# Altium project TR8253-EVB-PDI-1_0.PrjPCB
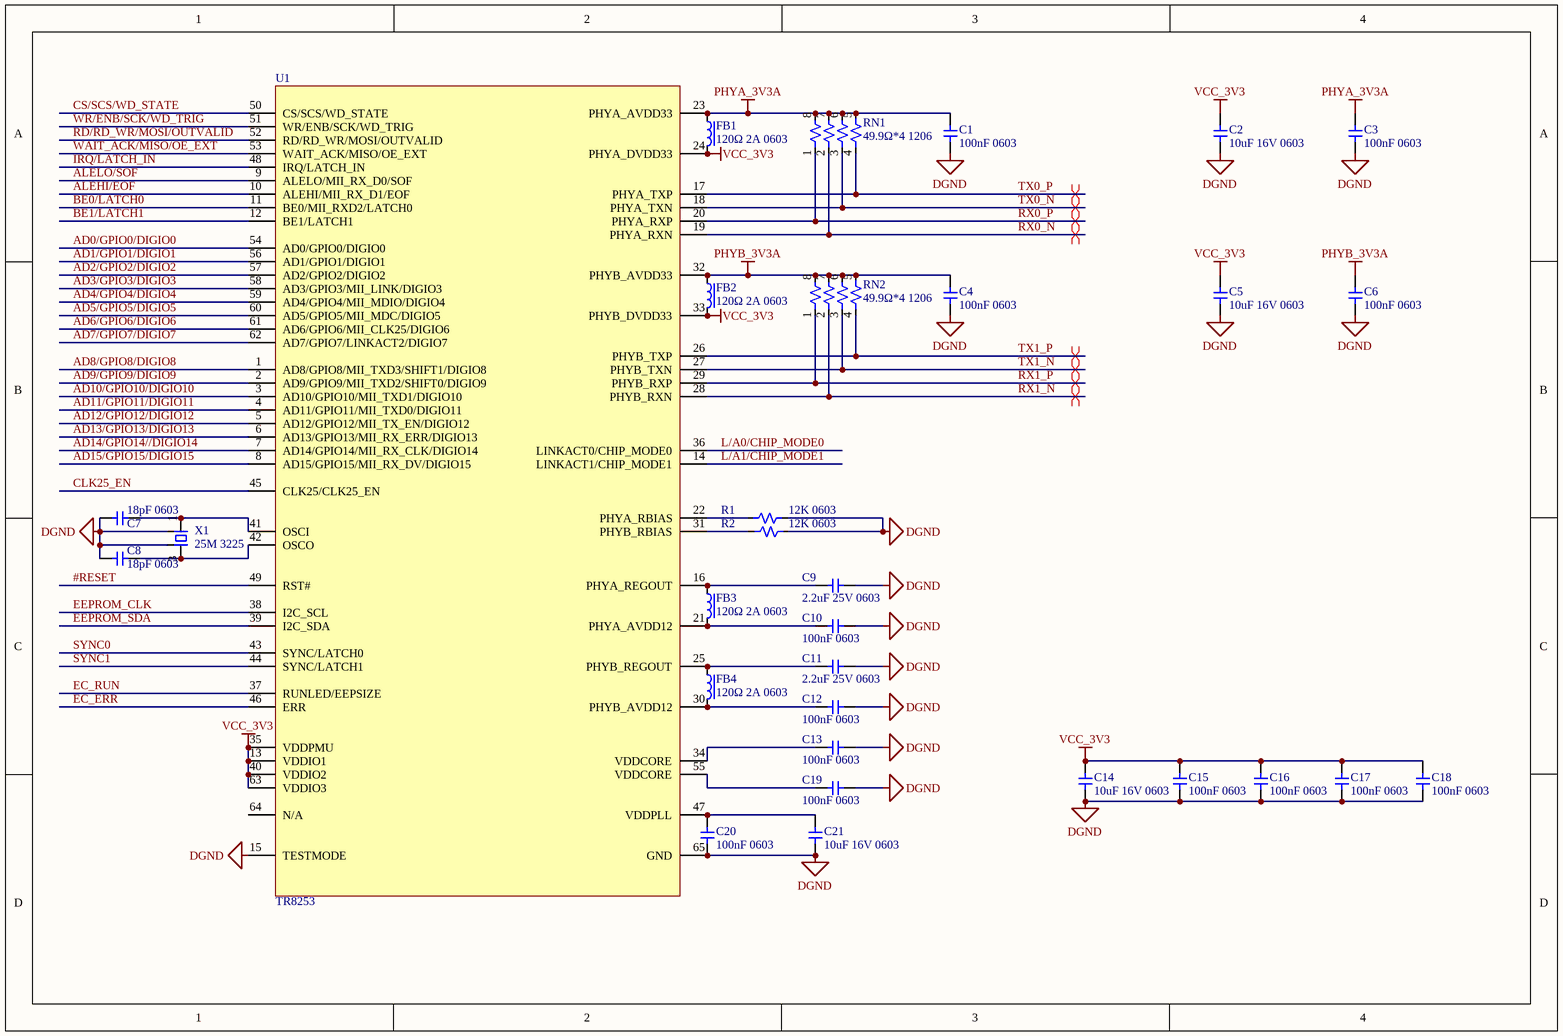
[diagram p0: SCH-TR8253.SchDoc]
5 sheets, 103 parts. Net scope: global (net labels, ports and power ports of the same name join across sheets).
Board files: TR8253-EVB-PDI-1_0.PcbDoc, TR8253-EVB-PDI-拼板x4-1_0.PcbDoc
Sheets:
  SCH-TR8253.SchDoc
  SCH-TR8253_config.SchDoc
  SCH-EC_port.SchDoc
  SCH-Power.SchDoc
  SCH-Connector.SchDoc

## Sheet SCH-TR8253.SchDoc
size A4

### Parts
C1  100nF 0603  [CAPC1608X08 (0603)]
C2  10uF 16V 0603  [CAPC1608X08 (0603)]
C3  100nF 0603  [CAPC1608X08 (0603)]
C4  100nF 0603  [CAPC1608X08 (0603)]
C5  10uF 16V 0603  [CAPC1608X08 (0603)]
C6  100nF 0603  [CAPC1608X08 (0603)]
C7  18pF 0603  [CAPC1608X08 (0603)]
C8  18pF 0603  [CAPC1608X08 (0603)]
C9  2.2uF 25V 0603  [CAPC1608X08 (0603)]
C10  100nF 0603  [CAPC1608X08 (0603)]
C11  2.2uF 25V 0603  [CAPC1608X08 (0603)]
C12  100nF 0603  [CAPC1608X08 (0603)]
C13  100nF 0603  [CAPC1608X08 (0603)]
C14  10uF 16V 0603  [CAPC1608X08 (0603)]
C15  100nF 0603  [CAPC1608X08 (0603)]
C16  100nF 0603  [CAPC1608X08 (0603)]
C17  100nF 0603  [CAPC1608X08 (0603)]
C18  100nF 0603  [CAPC1608X08 (0603)]
C19  100nF 0603  [CAPC1608X08 (0603)]
C20  100nF 0603  [CAPC1608X08 (0603)]
C21  10uF 16V 0603  [CAPC1608X08 (0603)]
FB1  120Ω 2A 0603  [INDC1608X08 (0603)]
FB2  120Ω 2A 0603  [INDC1608X08 (0603)]
FB3  120Ω 2A 0603  [INDC1608X08 (0603)]
FB4  120Ω 2A 0603  [INDC1608X08 (0603)]
R1  12K 0603  [RESC1608X04 (0603)]
R2  12K 0603  [RESC1608X04 (0603)]
RN1  49.9Ω*4 1206  [CAC-80P320X160-8 (1206)]
RN2  49.9Ω*4 1206  [CAC-80P320X160-8 (1206)]
U1  TR8253  [QFN50P900X900X100_HS-65M]
X1  25M 3225  [SON220P250X80-4N-(3225)]

### Nets
DGND: C1.1 C2.2 C3.2 C4.1 C5.2 C6.2 C7.2 C8.2 C9.2 C10.2 C11.2 C12.2 C13.2 C14.1 C15.1 C16.1 C17.1 C18.1 C19.2 C20.2 C21.2 R1.1 R2.2 U1.15(TESTMODE) U1.65(GND) X1.2 X1.4
PHYA_3V3A: C1.2 C3.1 FB1.1 RN1.5 RN1.6 RN1.7 RN1.8 U1.23(PHYA_AVDD33)
PHYB_3V3A: C4.2 C6.1 FB2.1 RN2.5 RN2.6 RN2.7 RN2.8 U1.32(PHYB_AVDD33)
VCC_3V3: C2.1 C5.1 C14.2 C15.2 C16.2 C17.2 C18.2 FB1.2 FB2.2 U1.13(VDDIO1) U1.24(PHYA_DVDD33) U1.33(PHYB_DVDD33) U1.35(VDDPMU) U1.40(VDDIO2) U1.63(VDDIO3)
#RESET: U1.49(RST#)
AD0/GPIO0/DIGIO0: U1.54(AD0/GPIO0/DIGIO0)
AD1/GPIO1/DIGIO1: U1.56(AD1/GPIO1/DIGIO1)
AD2/GPIO2/DIGIO2: U1.57(AD2/GPIO2/DIGIO2)
AD3/GPIO3/DIGIO3: U1.58(AD3/GPIO3/MII_LINK/DIGIO3)
AD4/GPIO4/DIGIO4: U1.59(AD4/GPIO4/MII_MDIO/DIGIO4)
AD5/GPIO5/DIGIO5: U1.60(AD5/GPIO5/MII_MDC/DIGIO5)
AD6/GPIO6/DIGIO6: U1.61(AD6/GPIO6/MII_CLK25/DIGIO6)
AD7/GPIO7/DIGIO7: U1.62(AD7/GPIO7/LINKACT2/DIGIO7)
AD8/GPIO8/DIGIO8: U1.1(AD8/GPIO8/MII_TXD3/SHIFT1/DIGIO8)
AD9/GPIO9/DIGIO9: U1.2(AD9/GPIO9/MII_TXD2/SHIFT0/DIGIO9)
AD10/GPIO10/DIGIO10: U1.3(AD10/GPIO10/MII_TXD1/DIGIO10)
AD11/GPIO11/DIGIO11: U1.4(AD11/GPIO11/MII_TXD0/DIGIO11)
AD12/GPIO12/DIGIO12: U1.5(AD12/GPIO12/MII_TX_EN/DIGIO12)
AD13/GPIO13/DIGIO13: U1.6(AD13/GPIO13/MII_RX_ERR/DIGIO13)
AD14/GPIO14//DIGIO14: U1.7(AD14/GPIO14/MII_RX_CLK/DIGIO14)
AD15/GPIO15/DIGIO15: U1.8(AD15/GPIO15/MII_RX_DV/DIGIO15)
ALEHI/EOF: U1.10(ALEHI/MII_RX_D1/EOF)
ALELO/SOF: U1.9(ALELO/MII_RX_D0/SOF)
BE0/LATCH0: U1.11(BE0/MII_RXD2/LATCH0)
BE1/LATCH1: U1.12(BE1/LATCH1)
CLK25_EN: U1.45(CLK25/CLK25_EN)
CS/SCS/WD_STATE: U1.50(CS/SCS/WD_STATE)
EC_ERR: U1.46(ERR)
EC_RUN: U1.37(RUNLED/EEPSIZE)
EEPROM_CLK: U1.38(I2C_SCL)
EEPROM_SDA: U1.39(I2C_SDA)
IRQ/LATCH_IN: U1.48(IRQ/LATCH_IN)
L/A0/CHIP_MODE0: U1.36(LINKACT0/CHIP_MODE0)
L/A1/CHIP_MODE1: U1.14(LINKACT1/CHIP_MODE1)
RD/RD_WR/MOSI/OUTVALID: U1.52(RD/RD_WR/MOSI/OUTVALID)
RX0_N: RN1.2 U1.19(PHYA_RXN)
RX0_P: RN1.1 U1.20(PHYA_RXP)
RX1_N: RN2.2 U1.28(PHYB_RXN)
RX1_P: RN2.1 U1.29(PHYB_RXP)
SYNC0: U1.43(SYNC/LATCH0)
SYNC1: U1.44(SYNC/LATCH1)
TX0_N: RN1.3 U1.18(PHYA_TXN)
TX0_P: RN1.4 U1.17(PHYA_TXP)
TX1_N: RN2.3 U1.27(PHYB_TXN)
TX1_P: RN2.4 U1.26(PHYB_TXP)
WAIT_ACK/MISO/OE_EXT: U1.53(WAIT_ACK/MISO/OE_EXT)
WR/ENB/SCK/WD_TRIG: U1.51(WR/ENB/SCK/WD_TRIG)
NetC7_1: C7.1 U1.41(OSCI) X1.1
NetC8_1: C8.1 U1.42(OSCO) X1.3
NetC9_1: C9.1 FB3.1 U1.16(PHYA_REGOUT)
NetC10_1: C10.1 FB3.2 U1.21(PHYA_AVDD12)
NetC11_1: C11.1 FB4.1 U1.25(PHYB_REGOUT)
NetC12_1: C12.1 FB4.2 U1.30(PHYB_AVDD12)
NetC13_1: C13.1 U1.34(VDDCORE)
NetC19_1: C19.1 U1.55(VDDCORE)
NetC20_1: C20.1 C21.1 U1.47(VDDPLL)
NetR1_2: R1.2 U1.22(PHYA_RBIAS)
NetR2_1: R2.1 U1.31(PHYB_RBIAS)

Not connected (* = marked no-connect by the designer): U1 64(N/A)

### Layout directives
differential pair: RX0_N, RX0_P, RX1_N, RX1_P, TX0_N, TX0_P, TX1_N, TX1_P

### Library data of the parts
C1 C3 C4 C6 C10 C12 C13 C15-C20 = 100nF 0603: 贴片MLCC电容 100nF 50V X7R 10% 0603; 1st Manufacturer: Yageo; 1st PartNumber: CC0603KRX7R9BB104; 2nd Manufacturer: TDK; 2nd PartNumber: CGA3E2X7R1H104K080AA; ERP_ID: 12A20039
C2 C5 C14 C21 = 10uF 16V 0603: 贴片MLCC电容 10uF 16V X5R 20% 0603; 1st Manufacturer: YAGEO; 1st PartNumber: CC0603KRX5R7BB106; ERP_ID: 12A20110
C7 C8 = 18pF 0603: 贴片MLCC电容 18pF 50V NPO 5% 0603; 1st Manufacturer: Yageo; 1st PartNumber: CC0603JRNPO9BN180; ERP_ID: 12A20092
C9 C11 = 2.2uF 25V 0603: 贴片MLCC电容 2.2uF 25V X5R 10% 0603; 1st Manufacturer: Yageo; 1st PartNumber: CC0603KRX5R8BB225; ERP_ID: 12A20113
FB1-FB4 = 120Ω@100MHz 2A 0603: 电源线磁珠 0603 120Ω@100MHz 2A; 1st PartNumber: PZ1608U121-2R0TF; 1st Manufacturer: 顺络; 2nd Manufacturer: Murata; 2nd PartNumber: BLM18PG121SN1D; ERP_ID: 12A40009
R1 R2 = 12K 0603: 贴片厚膜电阻 12kΩ 1% 0603; 1st Manufacturer: Yageo; 2nd Manufacturer: Bourns; 2nd PartNumber: CR0603-FX-1202ELF; 1st PartNumber: RC0603FR-0712KL; ERP_ID: 12A10055
RN1 RN2 = 49.9Ω*4 1206: 贴片排阻 49.9Ω 5% 4x0603; 1st Manufacturer: Yageo; 2nd Manufacturer: Bourns; 2nd PartNumber: CAY16-49R9F4LF; 1st PartNumber: YC164-FR-0749R9L; ERP_ID: 12A10157
U1 = TR8253: 2/3端口内置以太网PHY的EtherCAT从站控制器; 1st Manufacturer: 创耀; ERP_ID: -; 1st PartNumber: TR8253
X1 = 25M 20ppm 3225: 贴片无源晶振 25MHz 20ppm 12pF; 1st Manufacturer: TXC; 1st PartNumber: 7M-25.000MDHE-T; ERP_ID: 12A50002

## Sheet SCH-TR8253_config.SchDoc
size A4
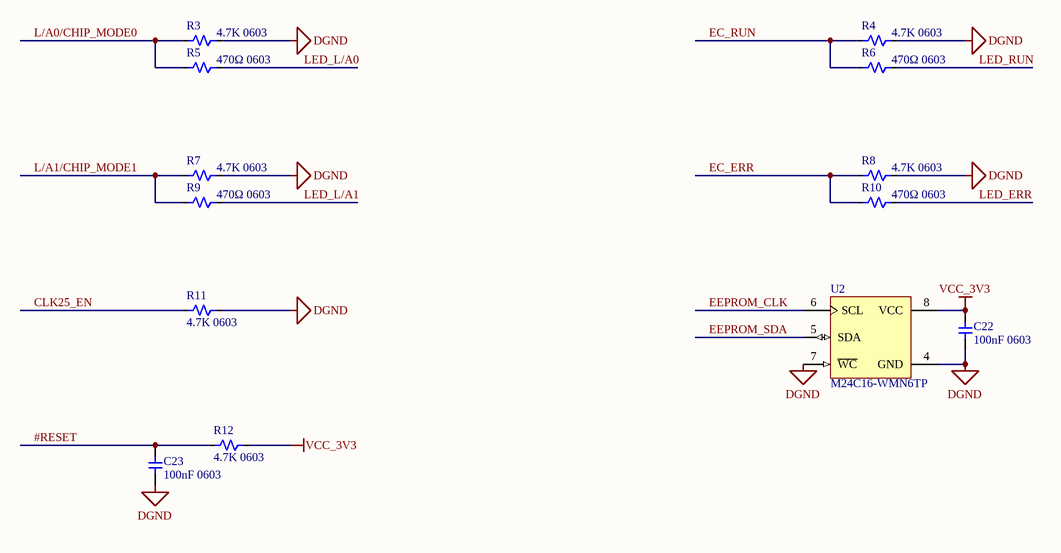
[diagram p1: SCH-TR8253_config.SchDoc]

### Parts
C22  100nF 0603  [CAPC1608X08 (0603)]
C23  100nF 0603  [CAPC1608X08 (0603)]
R3  4.7K 0603  [RESC1608X04 (0603)]
R4  4.7K 0603  [RESC1608X04 (0603)]
R5  470Ω 0603  [RESC1608X04 (0603)]
R6  470Ω 0603  [RESC1608X04 (0603)]
R7  4.7K 0603  [RESC1608X04 (0603)]
R8  4.7K 0603  [RESC1608X04 (0603)]
R9  470Ω 0603  [RESC1608X04 (0603)]
R10  470Ω 0603  [RESC1608X04 (0603)]
R11  4.7K 0603  [RESC1608X04 (0603)]
R12  4.7K 0603  [RESC1608X04 (0603)]
U2  M24C16-WMN6TP  [SOIC127P600X175-8N]

### Nets
DGND: C22.2 C23.2 R3.1 R4.1 R7.1 R8.1 R11.1 U2.4(GND) U2.7(~{WC})
VCC_3V3: C22.1 R12.1 U2.8(VCC)
#RESET: C23.1 R12.2
CLK25_EN: R11.2
EC_ERR: R8.2 R10.2
EC_RUN: R4.2 R6.2
EEPROM_CLK: U2.6(SCL)
EEPROM_SDA: U2.5(SDA)
L/A0/CHIP_MODE0: R3.2 R5.2
L/A1/CHIP_MODE1: R7.2 R9.2
LED_ERR: R10.1
LED_L/A0: R5.1
LED_L/A1: R9.1
LED_RUN: R6.1

### Library data of the parts
C22 C23 = 100nF 0603: as C1 on sheet SCH-TR8253
R3 R4 R7 R8 R11 R12 = 4.7K 0603: 贴片厚膜电阻 4.7kΩ 1% 0603; 1st Manufacturer: Yageo; 1st PartNumber: RC0603FR-074K7L; 2nd Manufacturer: Bourns; 2nd PartNumber: CR0603-FX-4701ELF; ERP_ID: 12A10041
R5 R6 R9 R10 = 470Ω 0603: 贴片厚膜电阻 470Ω 1% 0603; 1st Manufacturer: Yageo; 1st PartNumber: RC0603FR-07470RL; 2nd Manufacturer: Bourns; 2nd PartNumber: CR0603-FX-4700ELF; ERP_ID: 12A10103
U2 = M24C16-WMN6TP: I2C串行EEPROM 16K; 1st Manufacturer: ST; 2nd Manufacturer: 复旦微; 2nd PartNumber: FM24C16D-SO-T; ERP_ID: 11B20023; 1st PartNumber: M24C16-WMN6TP

## Sheet SCH-EC_port.SchDoc
size A4
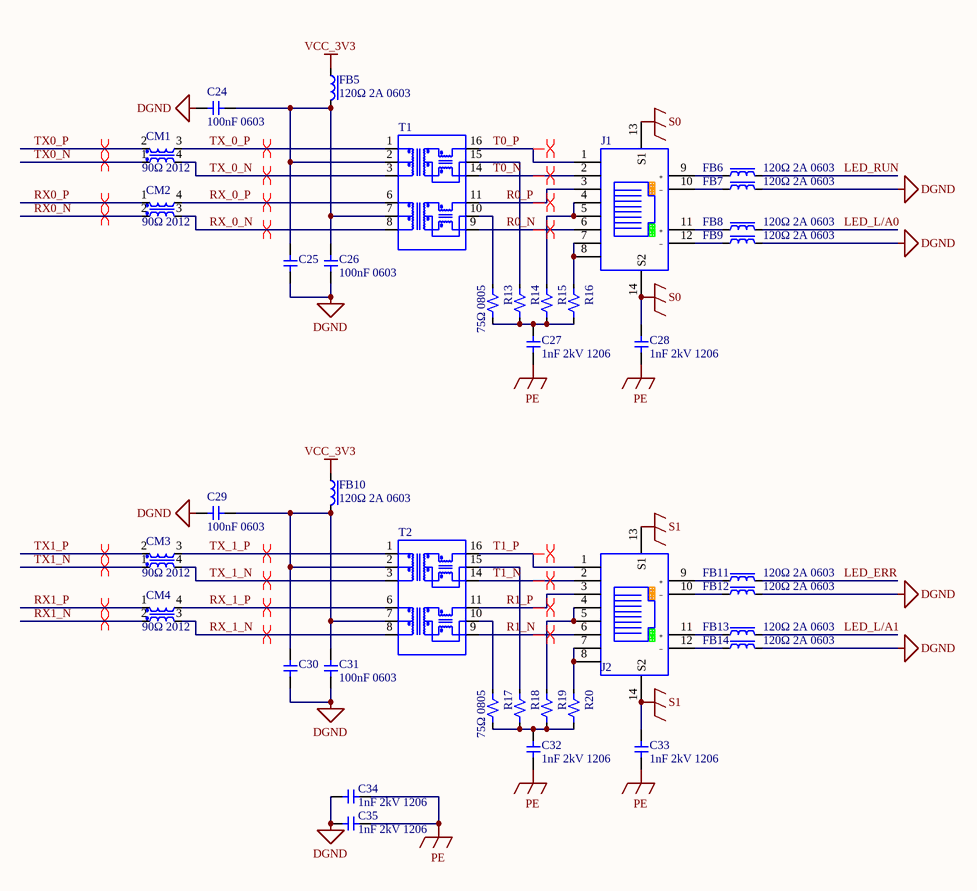
[diagram p2: SCH-EC_port.SchDoc]

### Parts
C24  100nF 0603  [CAPC1608X08 (0603)]
C25  100nF 0603  [CAPC1608X08 (0603)]  (value not drawn)
C26  100nF 0603  [CAPC1608X08 (0603)]
C27  1nF 2kV 1206  [CAPC3216X16 (1206)]
C28  1nF 2kV 1206  [CAPC3216X16 (1206)]
C29  100nF 0603  [CAPC1608X08 (0603)]
C30  100nF 0603  [CAPC1608X08 (0603)]  (value not drawn)
C31  100nF 0603  [CAPC1608X08 (0603)]
C32  1nF 2kV 1206  [CAPC3216X16 (1206)]
C33  1nF 2kV 1206  [CAPC3216X16 (1206)]
C34  1nF 2kV 1206  [CAPC3216X16 (1206)]
C35  1nF 2kV 1206  [CAPC3216X16 (1206)]
CM1  90Ω 2012  [CAF-80P120X200-4N]
CM2  90Ω 2012  [CAF-80P120X200-4N]
CM3  90Ω 2012  [CAF-80P120X200-4N]
CM4  90Ω 2012  [CAF-80P120X200-4N]
FB5  120Ω 2A 0603  [INDC1608X08 (0603)]
FB6  120Ω 2A 0603  [INDC1608X08 (0603)]
FB7  120Ω 2A 0603  [INDC1608X08 (0603)]
FB8  120Ω 2A 0603  [INDC1608X08 (0603)]
FB9  120Ω 2A 0603  [INDC1608X08 (0603)]
FB10  120Ω 2A 0603  [INDC1608X08 (0603)]
FB11  120Ω 2A 0603  [INDC1608X08 (0603)]
FB12  120Ω 2A 0603  [INDC1608X08 (0603)]
FB13  120Ω 2A 0603  [INDC1608X08 (0603)]
FB14  120Ω 2A 0603  [INDC1608X08 (0603)]
J1  1901-396X  [1901-396X]  (value not drawn)
J2  1901-396X  [1901-396X]  (value not drawn)
R13  75Ω 0805  [RESC2012X05 (0805)]
R14  75Ω 0805  [RESC2012X05 (0805)]  (value not drawn)
R15  75Ω 0805  [RESC2012X05 (0805)]  (value not drawn)
R16  75Ω 0805  [RESC2012X05 (0805)]  (value not drawn)
R17  75Ω 0805  [RESC2012X05 (0805)]
R18  75Ω 0805  [RESC2012X05 (0805)]  (value not drawn)
R19  75Ω 0805  [RESC2012X05 (0805)]  (value not drawn)
R20  75Ω 0805  [RESC2012X05 (0805)]  (value not drawn)
T1  H1601CE  [SOIC127P940X640-16N]  (value not drawn)
T2  H1601CE  [SOIC127P940X640-16N]  (value not drawn)

### Nets
DGND: C24.2 C25.2 C26.2 C29.2 C30.2 C31.2 C34.1 C35.1 FB7.2 FB9.2 FB12.2 FB14.2
PE: C27.2 C28.2 C32.2 C33.2 C34.2 C35.2
S0: C28.1 J1.13(S1) J1.14(S2)
S1: C33.1 J2.13(S1) J2.14(S2)
VCC_3V3: FB5.1 FB10.1
LED_ERR: FB11.2
LED_L/A0: FB8.2
LED_L/A1: FB13.2
LED_RUN: FB6.2
R0_N: J1.6(Rx-) T1.9
R0_P: J1.3(Rx+) T1.11
R1_N: J2.6(Rx-) T2.9
R1_P: J2.3(Rx+) T2.11
RX0_N: CM2.2
RX0_P: CM2.1
RX1_N: CM4.2
RX1_P: CM4.1
RX_0_N: CM2.3 T1.8
RX_0_P: CM2.4 T1.6
RX_1_N: CM4.3 T2.8
RX_1_P: CM4.4 T2.6
T0_N: J1.2(Tx-) T1.14
T0_P: J1.1(Tx+) T1.16
T1_N: J2.2(Tx-) T2.14
T1_P: J2.1(Tx+) T2.16
TX0_N: CM1.1
TX0_P: CM1.2
TX1_N: CM3.1
TX1_P: CM3.2
TX_0_N: CM1.4 T1.3
TX_0_P: CM1.3 T1.1
TX_1_N: CM3.4 T2.3
TX_1_P: CM3.3 T2.1
NetC24_1: C24.1 C25.1 C26.1 FB5.2 T1.2 T1.7
NetC27_1: C27.1 R13.1 R14.1 R15.1 R16.1
NetC29_1: C29.1 C30.1 C31.1 FB10.2 T2.2 T2.7
NetC32_1: C32.1 R17.1 R18.1 R19.1 R20.1
NetFB6_1: FB6.1 J1.9(﹢)
NetFB7_1: FB7.1 J1.10(﹣)
NetFB8_1: FB8.1 J1.11(﹢)
NetFB9_1: FB9.1 J1.12(﹣)
NetFB11_1: FB11.1 J2.9(﹢)
NetFB12_1: FB12.1 J2.10(﹣)
NetFB13_1: FB13.1 J2.11(﹢)
NetFB14_1: FB14.1 J2.12(﹣)
NetJ1_4: J1.4 J1.5 R15.2
NetJ1_7: J1.7 J1.8 R16.2
NetJ2_4: J2.4 J2.5 R19.2
NetJ2_7: J2.7 J2.8 R20.2
NetR13_2: R13.2 T1.10
NetR14_2: R14.2 T1.15
NetR17_2: R17.2 T2.10
NetR18_2: R18.2 T2.15

### Layout directives
differential pair: R0_N, R0_P, R1_N, R1_P, RX0_N, RX0_P, RX1_N, RX1_P, RX_0_N, RX_0_P, RX_1_N, RX_1_P, T0_N, T0_P, T1_N, T1_P, TX0_N, TX0_P, TX1_N, TX1_P, TX_0_N, TX_0_P, TX_1_N, TX_1_P

### Library data of the parts
C24-C26 C29-C31 = 100nF 0603: as C1 on sheet SCH-TR8253
C27 C28 C32-C35 = 1nF 2kV 1206: 贴片MLCC电容 1.0nF 2KV X7R 10% 1206; 1st Manufacturer: Yageo; 1st PartNumber: CC1206KKX7RDBB102; ERP_ID: 12A20057
CM1-CM4 = 90Ω@100MHz 2012: 高速信号共模滤波器 90Ω@100MHz, 0.33A, 2012; 1st PartNumber: SDCW2012-2-900TF; 1st Manufacturer: 顺络; 2nd Manufacturer: TDK; 2nd PartNumber: ACM2012E-900-2P-T01; ERP_ID: 12A40029
FB5-FB14 = 120Ω@100MHz 2A 0603: as FB1 on sheet SCH-TR8253
J1 J2 = 1901-396X: 以太网连接器 90度弯 带灯（左黄右绿）金属外壳 EMI弹片; 1st Manufacturer: KINSUN; ERP_ID: 15C80007; 1st PartNumber: 1901-396X; 2nd Manufacturer: -; 2nd PartNumber: -
R13-R20 = 75Ω 0805: 贴片厚膜电阻 75Ω 1% 0805; 1st Manufacturer: Yageo; 1st PartNumber: RC0805FR-0775RL; 2nd Manufacturer: Bourns; 2nd PartNumber: CR0805-FX-75R0ELF; ERP_ID: 12A10083
T1 T2 = H1601CE: 单口百兆网络隔离变压器; 1st Manufacturer: MNC; 2nd Manufacturer: Pulse; 2nd PartNumber: H1102NL; ERP_ID: 12B20002; 1st PartNumber: H1601CE

## Sheet SCH-Power.SchDoc
size A4
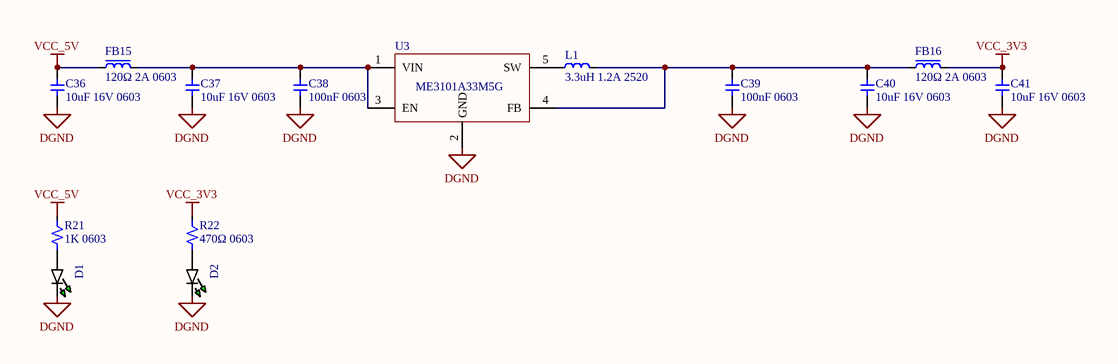
[diagram p3: SCH-Power.SchDoc]

### Parts
C36  10uF 16V 0603  [CAPC1608X08 (0603)]
C37  10uF 16V 0603  [CAPC1608X08 (0603)]
C38  100nF 0603  [CAPC1608X08 (0603)]
C39  100nF 0603  [CAPC1608X08 (0603)]
C40  10uF 16V 0603  [CAPC1608X08 (0603)]
C41  10uF 16V 0603  [CAPC1608X08 (0603)]
D1  GR/0603  [DIOC1608X06N-(0603)]  (value not drawn)
D2  GR/0603  [DIOC1608X06N-(0603)]  (value not drawn)
FB15  120Ω 2A 0603  [INDC1608X08 (0603)]
FB16  120Ω 2A 0603  [INDC1608X08 (0603)]
L1  3.3uH 1.2A 2520  [INDC2520X10N-(2520)]
R21  1K 0603  [RESC1608X04 (0603)]
R22  470Ω 0603  [RESC1608X04 (0603)]
U3  ME3101A33M5G  [SOT95P280X145-5N]

### Nets
DGND: C36.2 C37.2 C38.2 C39.2 C40.2 C41.2 D1.1(A) D2.1(A) U3.2(GND)
VCC_3V3: C41.1 FB16.2 R22.2
VCC_5V: C36.1 FB15.1 R21.2
NetC37_1: C37.1 C38.1 FB15.2 U3.1(VIN) U3.3(EN)
NetC39_1: C39.1 C40.1 FB16.1 L1.2 U3.4(FB)
NetD1_2: D1.2(K) R21.1
NetD2_2: D2.2(K) R22.1
NetL1_1: L1.1 U3.5(SW)

### Library data of the parts
C36 C37 C40 C41 = 10uF 16V 0603: as C2 on sheet SCH-TR8253
C38 C39 = 100nF 0603: as C1 on sheet SCH-TR8253
D1 D2 = GR/0603: 标准LED-SMD Green Clear 569nm; 1st Manufacturer: LiteON; 1st PartNumber: LTST-C190GKT; 2nd Manufacturer: 可国产替代; ERP_ID: 14A10005; 2nd PartNumber: 可国产替代
FB15 FB16 = 120Ω@100MHz 2A 0603: as FB1 on sheet SCH-TR8253
L1 = 3.3uH 1.2A 2520: 叠片电感 2520 3.3uH 1.2A ±20%; 1st Manufacturer: 顺络; 1st PartNumber: MPL2520S3R3MHT; ERP_ID: 12A30021
R21 = 1K 0603: 贴片厚膜电阻 1kΩ 1% 0603; 1st Manufacturer: Yageo; 1st PartNumber: RC0603FR-071KL; 2nd Manufacturer: Bourns; 2nd PartNumber: CR0603-FX-1001ELF; ERP_ID: 12A10007
R22 = 470Ω 0603: as R5 on sheet SCH-TR8253_config
U3 = ME3101A33M5G: 6.5Vin, 3.3Vout, 500mA 同步降压转换器; 1st Manufacturer: 南京微盟; 2nd Manufacturer: TI; 2nd PartNumber: LM3671MFX-3.3/NOPB; ERP_ID: 11B20002; 1st PartNumber: ME3101A33M5G

## Sheet SCH-Connector.SchDoc
size A4
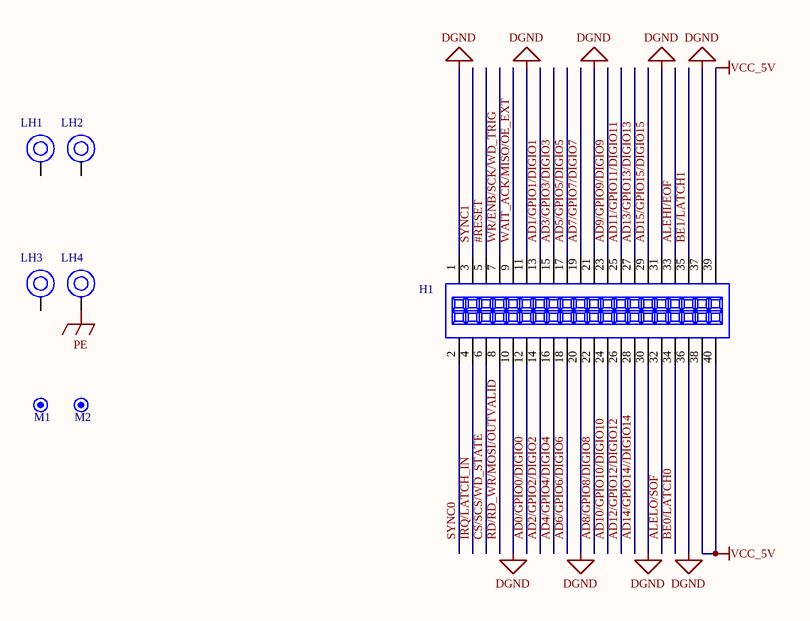
[diagram p4: SCH-Connector.SchDoc]

### Parts
H1  直插双排母2.4/4.3  [2.00 mm 直插双排母2.4/4.3 2X20P]  (value not drawn)
LH1  DPDT/24V/250VAC/30A  [LOCAL-HOLE-M3/5]  (value not drawn)  (no BOM)
LH2  DPDT/24V/250VAC/30A  [LOCAL-HOLE-M3/5]  (value not drawn)  (no BOM)
LH3  DPDT/24V/250VAC/30A  [LOCAL-HOLE-M3/5]  (value not drawn)  (no BOM)
LH4  DPDT/24V/250VAC/30A  [LOCAL-HOLE-M3/5]  (value not drawn)  (no BOM)
M1  MARK POINT  [MARK-POINT-1mm/2mm]  (value not drawn)  (no BOM)
M2  MARK POINT  [MARK-POINT-1mm/2mm]  (value not drawn)  (no BOM)

### Nets
DGND: H1.1 H1.10 H1.11 H1.20 H1.21 H1.30 H1.31 H1.36 H1.37
PE: LH4.0
VCC_5V: H1.38 H1.39 H1.40
#RESET: H1.5
AD0/GPIO0/DIGIO0: H1.12
AD1/GPIO1/DIGIO1: H1.13
AD2/GPIO2/DIGIO2: H1.14
AD3/GPIO3/DIGIO3: H1.15
AD4/GPIO4/DIGIO4: H1.16
AD5/GPIO5/DIGIO5: H1.17
AD6/GPIO6/DIGIO6: H1.18
AD7/GPIO7/DIGIO7: H1.19
AD8/GPIO8/DIGIO8: H1.22
AD9/GPIO9/DIGIO9: H1.23
AD10/GPIO10/DIGIO10: H1.24
AD11/GPIO11/DIGIO11: H1.25
AD12/GPIO12/DIGIO12: H1.26
AD13/GPIO13/DIGIO13: H1.27
AD14/GPIO14//DIGIO14: H1.28
AD15/GPIO15/DIGIO15: H1.29
ALEHI/EOF: H1.33
ALELO/SOF: H1.32
BE0/LATCH0: H1.34
BE1/LATCH1: H1.35
CS/SCS/WD_STATE: H1.6
IRQ/LATCH_IN: H1.4
RD/RD_WR/MOSI/OUTVALID: H1.8
SYNC0: H1.2
SYNC1: H1.3
WAIT_ACK/MISO/OE_EXT: H1.9
WR/ENB/SCK/WD_TRIG: H1.7

Not connected (* = marked no-connect by the designer): LH1 0; LH2 0; LH3 0

### Library data of the parts
H1 = HDR2.00mm/2x20/F: 2.00 mm 直插双排母 2.4/4.3 2X20P,2A; 1st Manufacturer: MECT; 1st PartNumber: 703-2S-3C-2*20PS-4.3/2.4; 2nd Manufacturer: 国产可替代; ERP_ID: 15C50144; 2nd PartNumber: 国产可替代
LH1-LH4 = LOCAL-HOLE: 定位孔
M1 M2 = MARK POINT: Mark点

## Nets that join several sheets
DGND: SCH-TR8253 (27 pins), SCH-TR8253_config (9 pins), SCH-EC_port (12 pins), SCH-Power (9 pins), SCH-Connector (9 pins)
PE: SCH-EC_port (6 pins), SCH-Connector (LH4.0)
VCC_3V3: SCH-TR8253 (15 pins), SCH-TR8253_config (C22.1 R12.1 U2.8), SCH-EC_port (FB5.1 FB10.1), SCH-Power (C41.1 FB16.2 R22.2)
VCC_5V: SCH-Power (C36.1 FB15.1 R21.2), SCH-Connector (H1.38 H1.39 H1.40)
#RESET: SCH-TR8253 (U1.49), SCH-TR8253_config (C23.1 R12.2), SCH-Connector (H1.5)
AD0/GPIO0/DIGIO0: SCH-TR8253 (U1.54), SCH-Connector (H1.12)
AD1/GPIO1/DIGIO1: SCH-TR8253 (U1.56), SCH-Connector (H1.13)
AD2/GPIO2/DIGIO2: SCH-TR8253 (U1.57), SCH-Connector (H1.14)
AD3/GPIO3/DIGIO3: SCH-TR8253 (U1.58), SCH-Connector (H1.15)
AD4/GPIO4/DIGIO4: SCH-TR8253 (U1.59), SCH-Connector (H1.16)
AD5/GPIO5/DIGIO5: SCH-TR8253 (U1.60), SCH-Connector (H1.17)
AD6/GPIO6/DIGIO6: SCH-TR8253 (U1.61), SCH-Connector (H1.18)
AD7/GPIO7/DIGIO7: SCH-TR8253 (U1.62), SCH-Connector (H1.19)
AD8/GPIO8/DIGIO8: SCH-TR8253 (U1.1), SCH-Connector (H1.22)
AD9/GPIO9/DIGIO9: SCH-TR8253 (U1.2), SCH-Connector (H1.23)
AD10/GPIO10/DIGIO10: SCH-TR8253 (U1.3), SCH-Connector (H1.24)
AD11/GPIO11/DIGIO11: SCH-TR8253 (U1.4), SCH-Connector (H1.25)
AD12/GPIO12/DIGIO12: SCH-TR8253 (U1.5), SCH-Connector (H1.26)
AD13/GPIO13/DIGIO13: SCH-TR8253 (U1.6), SCH-Connector (H1.27)
AD14/GPIO14//DIGIO14: SCH-TR8253 (U1.7), SCH-Connector (H1.28)
AD15/GPIO15/DIGIO15: SCH-TR8253 (U1.8), SCH-Connector (H1.29)
ALEHI/EOF: SCH-TR8253 (U1.10), SCH-Connector (H1.33)
ALELO/SOF: SCH-TR8253 (U1.9), SCH-Connector (H1.32)
BE0/LATCH0: SCH-TR8253 (U1.11), SCH-Connector (H1.34)
BE1/LATCH1: SCH-TR8253 (U1.12), SCH-Connector (H1.35)
CLK25_EN: SCH-TR8253 (U1.45), SCH-TR8253_config (R11.2)
CS/SCS/WD_STATE: SCH-TR8253 (U1.50), SCH-Connector (H1.6)
EC_ERR: SCH-TR8253 (U1.46), SCH-TR8253_config (R8.2 R10.2)
EC_RUN: SCH-TR8253 (U1.37), SCH-TR8253_config (R4.2 R6.2)
EEPROM_CLK: SCH-TR8253 (U1.38), SCH-TR8253_config (U2.6)
EEPROM_SDA: SCH-TR8253 (U1.39), SCH-TR8253_config (U2.5)
IRQ/LATCH_IN: SCH-TR8253 (U1.48), SCH-Connector (H1.4)
L/A0/CHIP_MODE0: SCH-TR8253 (U1.36), SCH-TR8253_config (R3.2 R5.2)
L/A1/CHIP_MODE1: SCH-TR8253 (U1.14), SCH-TR8253_config (R7.2 R9.2)
LED_ERR: SCH-TR8253_config (R10.1), SCH-EC_port (FB11.2)
LED_L/A0: SCH-TR8253_config (R5.1), SCH-EC_port (FB8.2)
LED_L/A1: SCH-TR8253_config (R9.1), SCH-EC_port (FB13.2)
LED_RUN: SCH-TR8253_config (R6.1), SCH-EC_port (FB6.2)
RD/RD_WR/MOSI/OUTVALID: SCH-TR8253 (U1.52), SCH-Connector (H1.8)
RX0_N: SCH-TR8253 (RN1.2 U1.19), SCH-EC_port (CM2.2)
RX0_P: SCH-TR8253 (RN1.1 U1.20), SCH-EC_port (CM2.1)
RX1_N: SCH-TR8253 (RN2.2 U1.28), SCH-EC_port (CM4.2)
RX1_P: SCH-TR8253 (RN2.1 U1.29), SCH-EC_port (CM4.1)
SYNC0: SCH-TR8253 (U1.43), SCH-Connector (H1.2)
SYNC1: SCH-TR8253 (U1.44), SCH-Connector (H1.3)
TX0_N: SCH-TR8253 (RN1.3 U1.18), SCH-EC_port (CM1.1)
TX0_P: SCH-TR8253 (RN1.4 U1.17), SCH-EC_port (CM1.2)
TX1_N: SCH-TR8253 (RN2.3 U1.27), SCH-EC_port (CM3.1)
TX1_P: SCH-TR8253 (RN2.4 U1.26), SCH-EC_port (CM3.2)
WAIT_ACK/MISO/OE_EXT: SCH-TR8253 (U1.53), SCH-Connector (H1.9)
WR/ENB/SCK/WD_TRIG: SCH-TR8253 (U1.51), SCH-Connector (H1.7)

## Assembly variants
1_0_A: not fitted C34 C35